# Altium schematic sheet TopSheet.SchDoc
size A4; CompanyName: Technische Hochschule Nürnberg Georg Simon Ohm; Organization: UltraZohm; Address1: Kesslerplatz 12; Address2: 90489 Nürnberg; Address3: GERMANY; DocumentNumber: 1; SheetNumber: 1; SheetTotal: 12; Website: www.ultrazohm.com
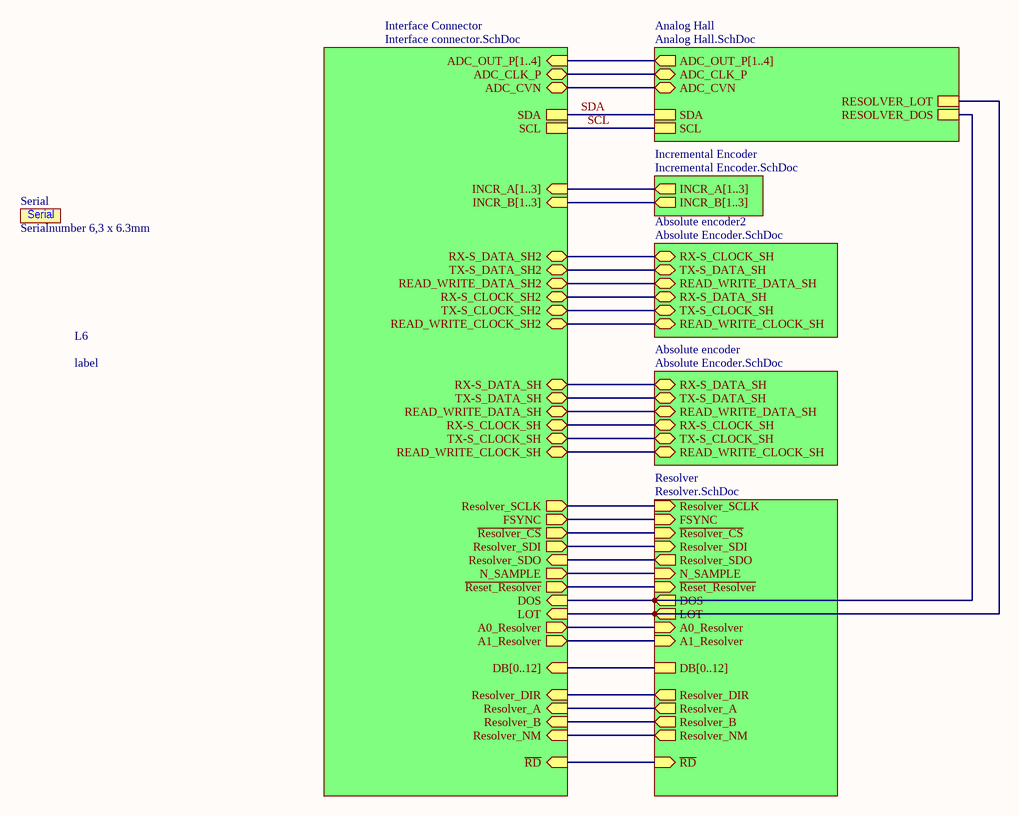
[diagram p0: TopSheet.SchDoc]

## Parts
L6  label  [revisioninfo]
Serial  Serialnumber 6,3 x 6.3mm  [Serial_6.3x6.3mm]  (no BOM)

## Sub-sheets
Absolute encoder = Absolute Encoder.SchDoc: TX-S_DATA_SH (bidir), READ_WRITE_DATA_SH (bidir), RX-S_CLOCK_SH (bidir), RX-S_DATA_SH (bidir), TX-S_CLOCK_SH (bidir), READ_WRITE_CLOCK_SH (bidir)
Absolute encoder2 = Absolute Encoder.SchDoc: TX-S_DATA_SH (bidir), READ_WRITE_DATA_SH (bidir), RX-S_CLOCK_SH (bidir), RX-S_DATA_SH (bidir), TX-S_CLOCK_SH (bidir), READ_WRITE_CLOCK_SH (bidir)
Analog Hall = Analog Hall.SchDoc: ADC_OUT_P[1..4] (out), ADC_CLK_P (bidir), ADC_CVN (bidir), SCL, SDA, RESOLVER_LOT, RESOLVER_DOS
Incremental Encoder = Incremental Encoder.SchDoc: INCR_B[1..3] (out), INCR_A[1..3] (out)
Interface Connector = Interface connector.SchDoc: ADC_CLK_P (bidir), ADC_OUT_P[1..4] (in), ADC_CVN (bidir), TX-S_DATA_SH (bidir), READ_WRITE_DATA_SH (bidir), RX-S_CLOCK_SH (bidir), RX-S_DATA_SH (bidir), TX-S_CLOCK_SH (bidir), READ_WRITE_CLOCK_SH (bidir), INCR_B[1..3] (in), INCR_A[1..3] (in), N_SAMPLE (out), Resolver_SDO (in), Resolver_SDI (out), FSYNC (out), Resolver_SCLK (out), ~{Reset_Resolver} (out), DOS (in), LOT (in), A0_Resolver (out), A1_Resolver (out), Resolver_B (in), Resolver_DIR (in), Resolver_NM (in), Resolver_A (in), ~{Resolver_CS} (out), DB[0..12] (in), READ_WRITE_CLOCK_SH2 (bidir), RX-S_DATA_SH2 (bidir), READ_WRITE_DATA_SH2 (bidir), TX-S_DATA_SH2 (bidir), RX-S_CLOCK_SH2 (bidir), TX-S_CLOCK_SH2 (bidir), SDA, SCL, ~{RD} (in)
Resolver = Resolver.SchDoc: N_SAMPLE (in), Resolver_SDO (out), Resolver_SDI (in), FSYNC (in), Resolver_SCLK (in), ~{Reset_Resolver} (in), DOS (out), LOT (out), A1_Resolver (in), A0_Resolver (in), ~{Resolver_CS} (in), Resolver_B (out), Resolver_DIR (out), Resolver_NM (out), Resolver_A (out), DB[0..12], ~{RD} (in)

## Nets
SCL: sheet Analog Hall/SCL, sheet Interface Connector/SCL
SDA: sheet Analog Hall/SDA, sheet Interface Connector/SDA
(unnamed): sheet Analog Hall/ADC_CLK_P, sheet Interface Connector/ADC_CLK_P
(unnamed): sheet Analog Hall/ADC_CVN, sheet Interface Connector/ADC_CVN
(unnamed): sheet Analog Hall/RESOLVER_LOT, sheet Interface Connector/LOT, sheet Resolver/LOT
(unnamed): sheet Analog Hall/RESOLVER_DOS, sheet Interface Connector/DOS, sheet Resolver/DOS
(unnamed): sheet Interface Connector/TX-S_DATA_SH, sheet Absolute encoder/TX-S_DATA_SH
(unnamed): sheet Interface Connector/READ_WRITE_DATA_SH, sheet Absolute encoder/READ_WRITE_DATA_SH
(unnamed): sheet Interface Connector/RX-S_CLOCK_SH, sheet Absolute encoder/RX-S_CLOCK_SH
(unnamed): sheet Interface Connector/RX-S_DATA_SH, sheet Absolute encoder/RX-S_DATA_SH
(unnamed): sheet Interface Connector/TX-S_CLOCK_SH, sheet Absolute encoder/TX-S_CLOCK_SH
(unnamed): sheet Interface Connector/READ_WRITE_CLOCK_SH, sheet Absolute encoder/READ_WRITE_CLOCK_SH
(unnamed): sheet Interface Connector/N_SAMPLE, sheet Resolver/N_SAMPLE
(unnamed): sheet Interface Connector/Resolver_SDO, sheet Resolver/Resolver_SDO
(unnamed): sheet Interface Connector/Resolver_SDI, sheet Resolver/Resolver_SDI
(unnamed): sheet Interface Connector/FSYNC, sheet Resolver/FSYNC
(unnamed): sheet Interface Connector/Resolver_SCLK, sheet Resolver/Resolver_SCLK
(unnamed): sheet Interface Connector/~{Reset_Resolver}, sheet Resolver/~{Reset_Resolver}
(unnamed): sheet Interface Connector/A0_Resolver, sheet Resolver/A0_Resolver
(unnamed): sheet Interface Connector/A1_Resolver, sheet Resolver/A1_Resolver
(unnamed): sheet Interface Connector/Resolver_B, sheet Resolver/Resolver_B
(unnamed): sheet Interface Connector/Resolver_DIR, sheet Resolver/Resolver_DIR
(unnamed): sheet Interface Connector/Resolver_NM, sheet Resolver/Resolver_NM
(unnamed): sheet Interface Connector/Resolver_A, sheet Resolver/Resolver_A
(unnamed): sheet Interface Connector/~{Resolver_CS}, sheet Resolver/~{Resolver_CS}
(unnamed): sheet Interface Connector/READ_WRITE_CLOCK_SH2, sheet Absolute encoder2/READ_WRITE_CLOCK_SH
(unnamed): sheet Interface Connector/RX-S_DATA_SH2, sheet Absolute encoder2/RX-S_CLOCK_SH
(unnamed): sheet Interface Connector/READ_WRITE_DATA_SH2, sheet Absolute encoder2/READ_WRITE_DATA_SH
(unnamed): sheet Interface Connector/TX-S_DATA_SH2, sheet Absolute encoder2/TX-S_DATA_SH
(unnamed): sheet Interface Connector/RX-S_CLOCK_SH2, sheet Absolute encoder2/RX-S_DATA_SH
(unnamed): sheet Interface Connector/TX-S_CLOCK_SH2, sheet Absolute encoder2/TX-S_CLOCK_SH
(unnamed): sheet Interface Connector/~{RD}, sheet Resolver/~{RD}

## Buses and harness runs
bus sheet Analog Hall/ADC_OUT_P[1..4] = sheet Interface Connector/ADC_OUT_P[1..4]
bus sheet Incremental Encoder/INCR_A[1..3] = sheet Interface Connector/INCR_A[1..3]
bus sheet Incremental Encoder/INCR_B[1..3] = sheet Interface Connector/INCR_B[1..3]
bus sheet Interface Connector/DB[0..12] = sheet Resolver/DB[0..12]

## Notes on the sheet
- Title
- Revision:
- Design Engineer:
- Date:
- Project:
- Sheet
- of

## Library data of the parts
Serial = SerialNumber: Created: 2018_09_18_AGeiger; Value: Serialnumber 6,3 x 6.3mm